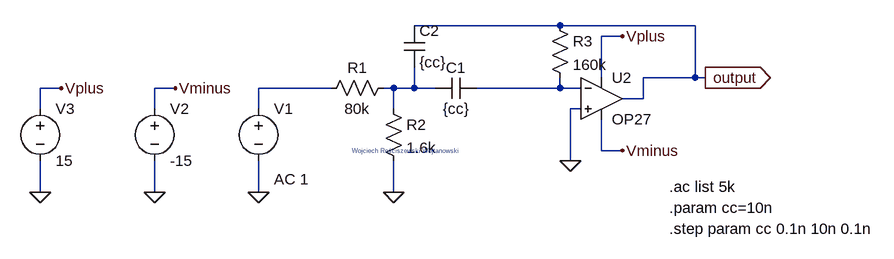
[diagram p0: schematic Analysis of the band-pass filter capacitance.asc]
Analysis of the band-pass filter capacitance.asc, the LTspice schematic file:
Version 4
SHEET 1 1192 680
WIRE 640 -144 416 -144
WIRE 848 -144 640 -144
WIRE 736 -128 704 -128
WIRE 704 -64 704 -128
WIRE 848 -64 848 -144
WIRE 848 -64 768 -64
WIRE 864 -64 848 -64
WIRE -128 -48 -160 -48
WIRE 48 -48 16 -48
WIRE 288 -48 176 -48
WIRE 384 -48 368 -48
WIRE 416 -48 416 -80
WIRE 416 -48 384 -48
WIRE 448 -48 416 -48
WIRE 640 -48 640 -64
WIRE 640 -48 512 -48
WIRE 672 -48 640 -48
WIRE 768 -32 768 -64
WIRE 768 -32 736 -32
WIRE -160 -16 -160 -48
WIRE 16 -16 16 -48
WIRE 176 -16 176 -48
WIRE 384 -16 384 -48
WIRE 672 -16 656 -16
WIRE 704 48 704 0
WIRE 736 48 704 48
WIRE 656 64 656 -16
WIRE -160 112 -160 64
WIRE 16 112 16 64
WIRE 176 112 176 64
WIRE 384 112 384 64
FLAG -160 112 0
FLAG 16 112 0
FLAG 176 112 0
FLAG 864 -64 output
IOPIN 864 -64 Out
FLAG 736 48 Vminus
FLAG 736 -128 Vplus
FLAG 48 -48 Vminus
FLAG -128 -48 Vplus
FLAG 384 112 0
FLAG 656 64 0
SYMBOL voltage 176 -32 R0
WINDOW 123 24 124 Left 2
WINDOW 39 0 0 Left 0
SYMATTR Value2 AC 1
SYMATTR InstName V1
SYMATTR Value ""
SYMBOL voltage 16 -32 R0
WINDOW 123 0 0 Left 0
WINDOW 39 0 0 Left 0
SYMATTR InstName V2
SYMATTR Value -15
SYMBOL voltage -160 -32 R0
WINDOW 123 0 0 Left 0
WINDOW 39 0 0 Left 0
SYMATTR InstName V3
SYMATTR Value 15
SYMBOL res 384 -64 R90
WINDOW 0 0 56 VBottom 2
WINDOW 3 32 56 VTop 2
SYMATTR InstName R1
SYMATTR Value 80k
SYMBOL cap 400 -144 R0
SYMATTR InstName C2
SYMATTR Value {cc}
SYMBOL cap 512 -64 R90
WINDOW 0 0 32 VBottom 2
WINDOW 3 32 32 VTop 2
SYMATTR InstName C1
SYMATTR Value {cc}
SYMBOL Opamps\\OP27 704 -96 R0
SYMATTR InstName U2
SYMBOL res 624 -160 R0
SYMATTR InstName R3
SYMATTR Value 160k
SYMBOL res 368 -32 R0
SYMATTR InstName R2
SYMATTR Value 1.6k
TEXT 808 104 Left 2 !.ac list 5k
TEXT 320 48 Left 0 ;Wojciech Rościszewski Wojtanowski
TEXT 808 136 Left 2 !.param cc=10n
TEXT 808 168 Left 2 !.step param cc 0.1n 10n 0.1n

The netlist it stands for:
* Analysis of the band-pass filter capacitance.asc
V1 N001 0 AC 1
V2 Vminus 0 -15
V3 Vplus 0 15
R1 N002 N001 80k
C2 output N002 {cc}
C1 N003 N002 {cc}
XU2 0 N003 Vplus Vminus output OP27  ; pins In+ In- V+ V- OUT
R3 output N003 160k
R2 N002 0 1.6k
.ac list 5k
* Wojciech Rościszewski Wojtanowski
.param cc=10n
.step param cc 0.1n 10n 0.1n
.lib ADI.lib
.backanno
.end